# Altium schematic sheet dcdc_5v0_3v3.SchDoc
size 220 x 124 mm; SheetNumber: 1; SheetTotal: 1
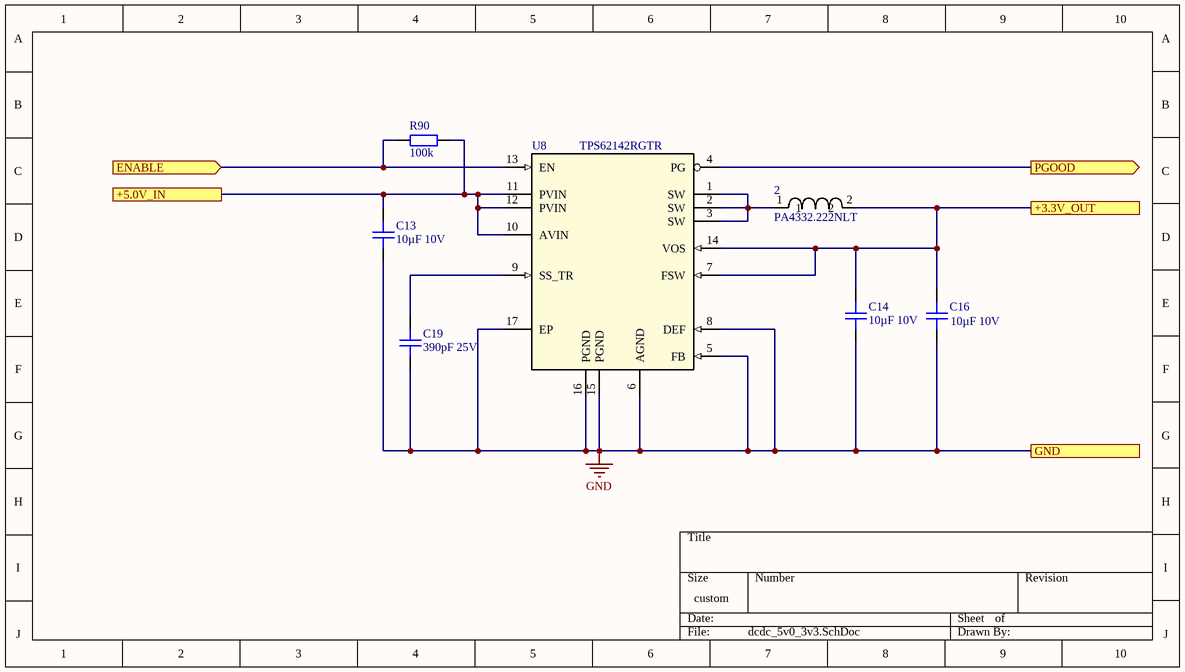
[diagram p0: dcdc_5v0_3v3.SchDoc]

## Parts
2  PA4332.222NLT  [PA4332]
C13  10µF 10V  [0805C]
C14  10µF 10V  [0805C]
C16  10µF 10V  [0805C]
C19  390pF 25V  [0402C]
R90  100k  [0603R]
U8  TPS62142RGTR  [RGT0016C]

## Ports
+3.3V_OUT, +5.0V_IN, ENABLE (in), GND, PGOOD (out)

## Nets
GND: C13.2 C14.2 C16.2 C19.1 U8.5(FB) U8.6(AGND) U8.8(DEF) U8.15(PGND) U8.16(PGND) U8.17(EP) ; port GND
+3.3V_OUT: 2.2 C14.1 C16.1 U8.7(FSW) U8.14(VOS) ; port +3.3V_OUT
+5.0V_IN: C13.1 R90.1 U8.10(AVIN) U8.11(PVIN) U8.12(PVIN) ; port +5.0V_IN
ENABLE: R90.2 U8.13(EN) ; port ENABLE
PGOOD: U8.4(PG) ; port PGOOD
Net2_1: 2.1 U8.1(SW) U8.2(SW) U8.3(SW)
NetC19_2: C19.2 U8.9(SS_TR)

## Library data of the parts
2 = PA4332.222NLT: Imported; Vendor: Pulse Engineering; Manufacturer_Part_Number: PA4332.222NLT; RefDes: RefDes; TYPE: TYPE; Value: Value
C13 C14 C16 = gen_C_ceramic_10u_10V_X7R_0805: Ceramic, 10µF, ±10%, 10V, X7R, –55 to 125°C, 0805 (2012),RoHS, Automotive; Part Number: GCJ21BR71A106KE01; Manufacturer: Murata; Case EIA: 0805; Case Metric: 2012; Automotive Qualified: True; PnP Package: C_0805_10; PnP Value: 10µF/10V/X7R; Capacitance: 10µF; Dielectric: X7R; Rated Voltage: 10V; Height - Seated (Max): 1.25mm; Mounting Type: SurfaceMount,MLCC; Operating Temperature: –55 to 125°C; Series: GCJ; Tolerance: ±10%; Manufacturer_Part_Number: GCJ21BR71A106KE01; Supplier 1: Digi-Key; Supplier Part Number 1: 490-12646-1-ND
C19 = gen_C_ceramic_390p_25V_C0G_0402: Ceramic, 390pF, ±5%, 25V, C0G, 25 to 125°C, 0402 (1005),RoHS, Automotive; Part Number: GCM1555C1H180JA16#; Manufacturer: Murata; Capacitance: 18p; Rated Voltage: 50V; Case EIA: 0402; Case Metric: 1005; Automotive Qualified: True; PnP Package: C_0402_10; PnP Value: 18pF/50V/X7R; Dielectric: C0G; Supplier 1: Digi-Key; Supplier Part Number 1: 490-12650-1-ND; Height - Seated (Max): 0.5mm; Mounting Type: SurfaceMount,MLCC; Operating Temperature: 25 to 125°C; Series: GCM; Tolerance: ±5%; Manufacturer_Part_Number: GCM1555C1H180JA16#
R90 = gen_R_100k_0603: SMD Resistor 100k 0603; Case EIA: 0603; Case Metric: 1608; PnP Package: R_0603; Automotive Qualified: False; Operating Temperature: -55°C - +155°C; PnP Value: 100k; Part Number: gen_R_100k_0603
U8 = TPS62142RGTR: Imported; Manufacturer: Texas Instruments; PartNumber: TPS62142RGTR; RefDes: RefDes; TYPE: TYPE; Value: Value